# Altium project Stm32_Doom.PrjPcb (part 1 of 2)
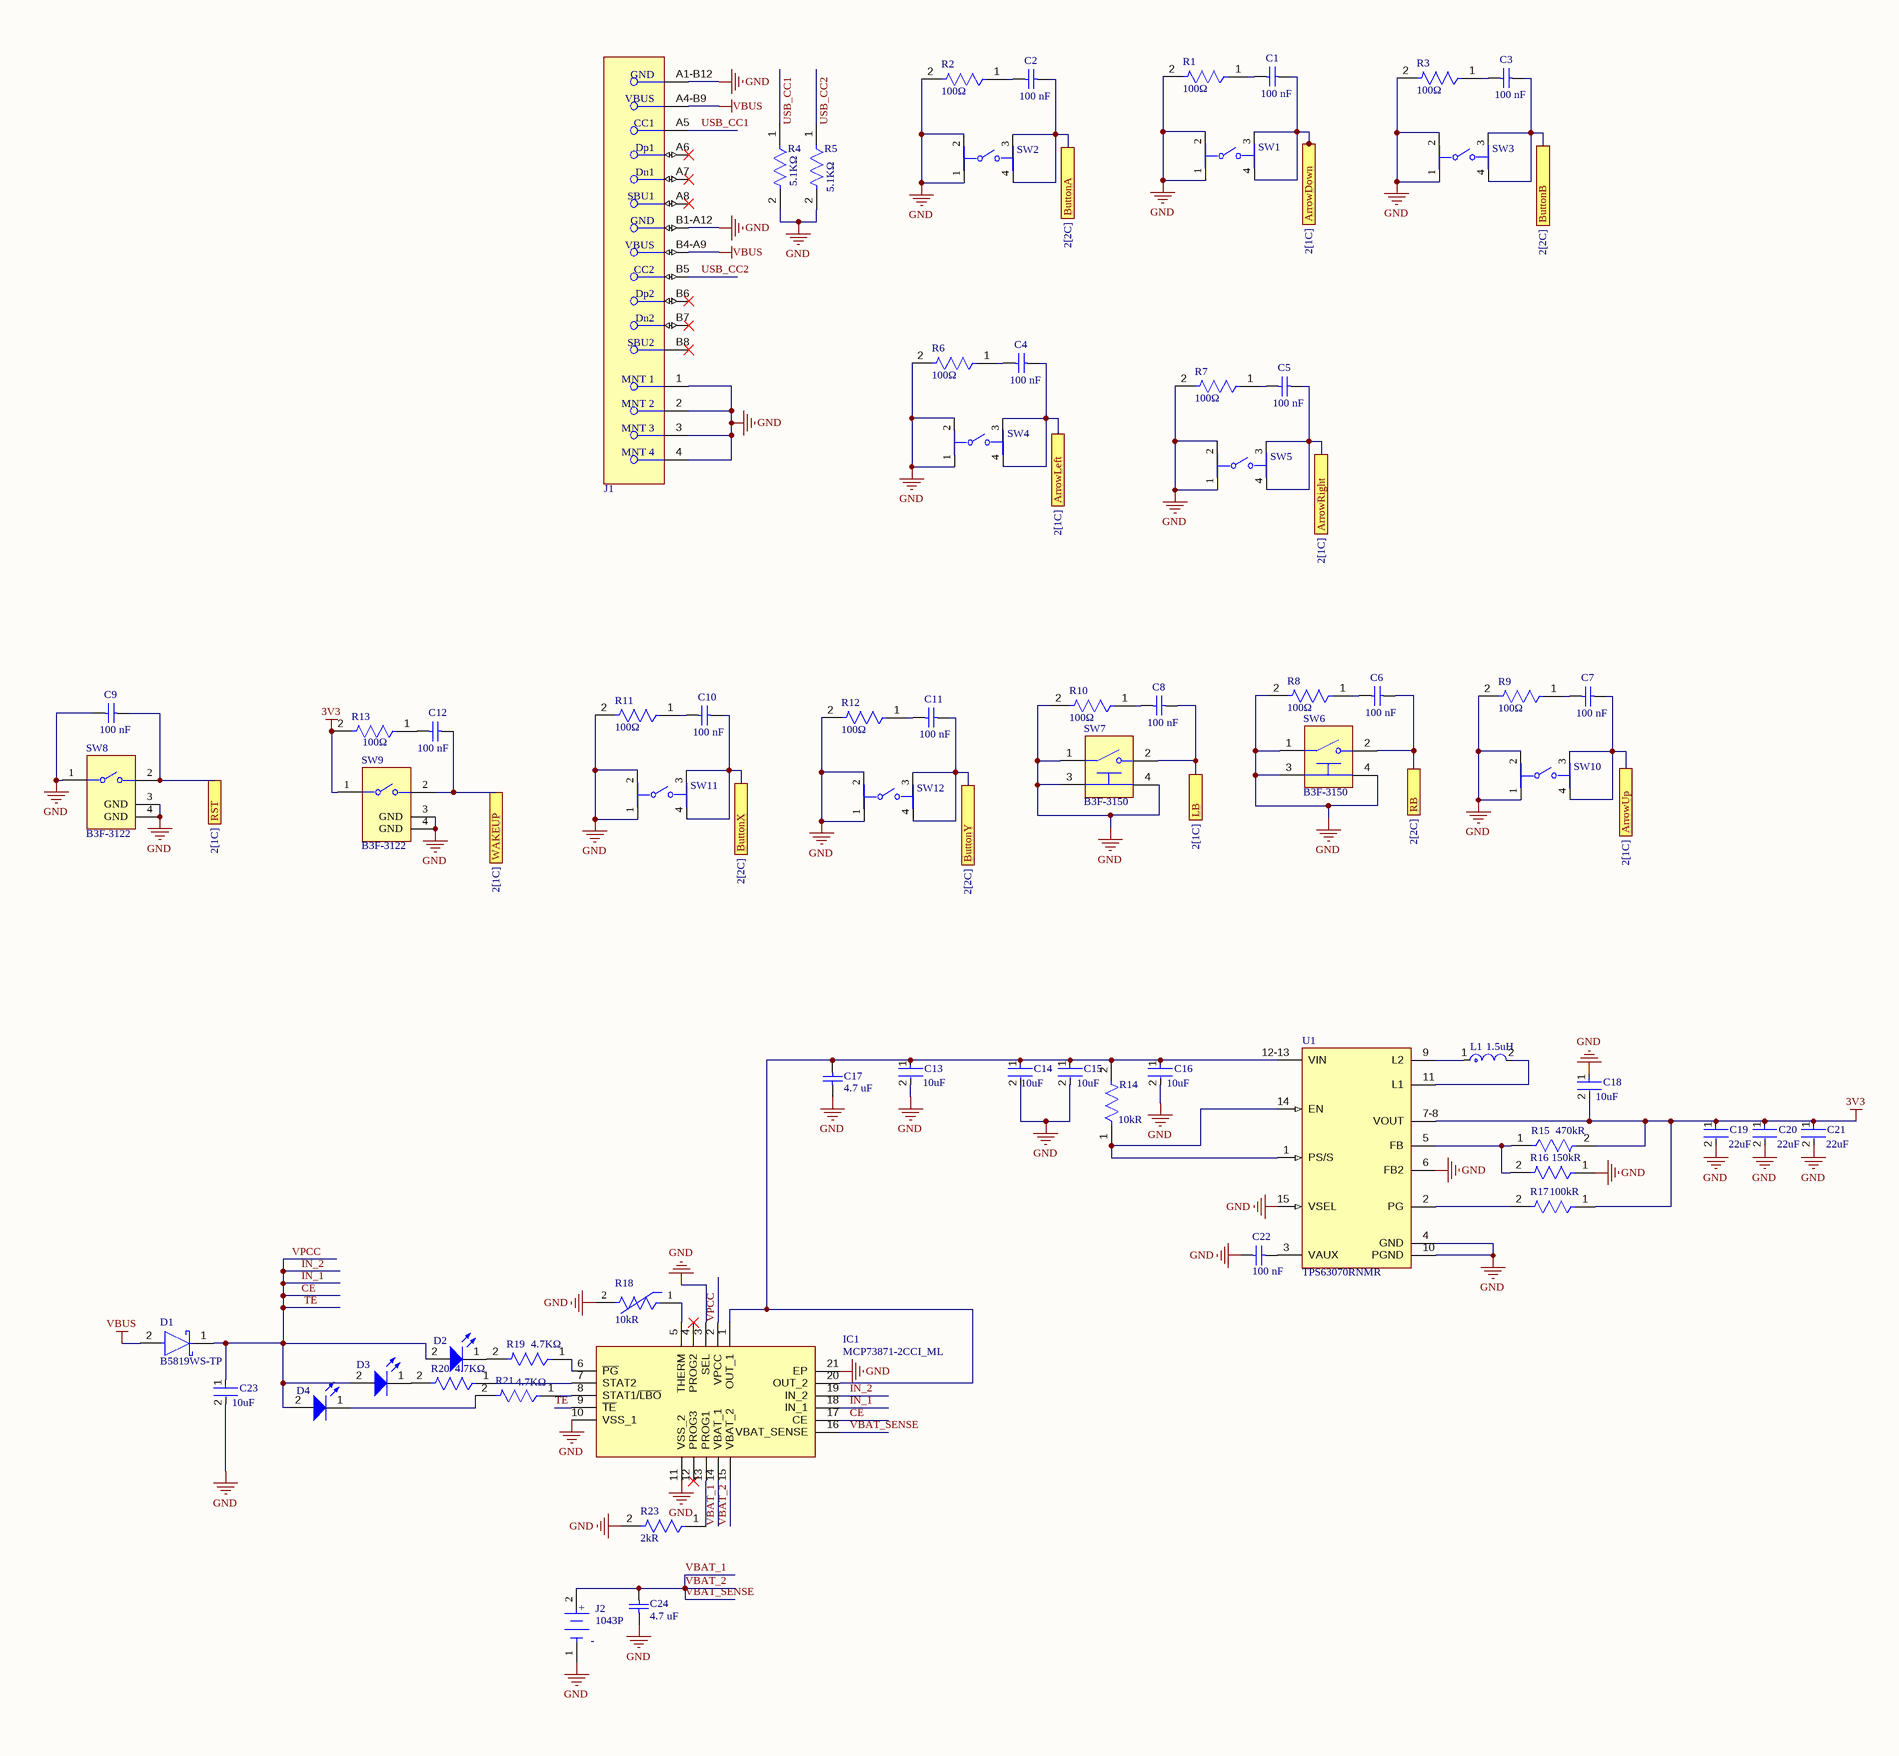
[diagram p0: POWER.SchDoc, left]
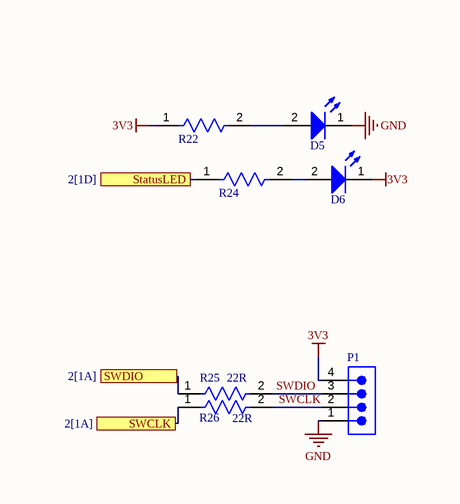
[diagram p1: POWER.SchDoc, right]
6 sheets, 155 parts. Net scope: flat (ports and power ports of the same name join across sheets).
Board file: PCB.PcbDoc
Sheets:
  POWER.SchDoc
  MCU.SchDoc
  SDCARD.SchDoc
  RAM.SchDoc
  LCD.SchDoc
  AUDIO.SchDoc

## Sheet POWER.SchDoc
size A2; SheetNumber: 1; SheetTotal: 6; SPICEModelCacheZVIZADMF: <root> / <DocumentId>ZVIZADMF</DocumentId> / </root>

### Parts
C1  value 100 nF  [CAPC2013X145X50LL20T25]  (hidden comment: C0805C104K9RACTU)
C2  value 100 nF  [CAPC2013X145X50LL20T25]  (hidden comment: C0805C104K9RACTU)
C3  value 100 nF  [CAPC2013X145X50LL20T25]  (hidden comment: C0805C104K9RACTU)
C4  value 100 nF  [CAPC2013X145X50LL20T25]  (hidden comment: C0805C104K9RACTU)
C5  value 100 nF  [CAPC2013X145X50LL20T25]  (hidden comment: C0805C104K9RACTU)
C6  value 100 nF  [CAPC2013X145X50LL20T25]  (hidden comment: C0805C104K9RACTU)
C7  value 100 nF  [CAPC2013X145X50LL20T25]  (hidden comment: C0805C104K9RACTU)
C8  value 100 nF  [CAPC2013X145X50LL20T25]  (hidden comment: C0805C104K9RACTU)
C9  value 100 nF  [CAPC2013X145X50LL20T25]  (hidden comment: C0805C104K9RACTU)
C10  value 100 nF  [CAPC2013X145X50LL20T25]  (hidden comment: C0805C104K9RACTU)
C11  value 100 nF  [CAPC2013X145X50LL20T25]  (hidden comment: C0805C104K9RACTU)
C12  value 100 nF  [CAPC2013X145X50LL20T25]  (hidden comment: C0805C104K9RACTU)
C13  Capacitance: 10uF  [FP-CL21-IPC_C]  (hidden comment: CL21A106MPFNNNF)
C14  Capacitance: 10uF  [FP-CL21-IPC_C]  (hidden comment: CL21A106MPFNNNF)
C15  Capacitance: 10uF  [FP-CL21-IPC_C]  (hidden comment: CL21A106MPFNNNF)
C16  Capacitance: 10uF  [FP-CL21-IPC_C]  (hidden comment: CL21A106MPFNNNF)
C17  value 4.7 uF  [CAPC2013X145X50NL20T25]  (hidden comment: C0805C475K9PACTU)
C18  Capacitance: 10uF  [FP-CL21-IPC_C]  (hidden comment: CL21A106MPFNNNF)
C19  Capacitance: 22uF  [FP-CL21-IPC_B]  (hidden comment: CL21A226MQCLQNC)
C20  Capacitance: 22uF  [FP-CL21-IPC_B]  (hidden comment: CL21A226MQCLQNC)
C21  Capacitance: 22uF  [FP-CL21-IPC_B]  (hidden comment: CL21A226MQCLQNC)
C22  value 100 nF  [CAPC1005X56X25LL10T15]  (hidden comment: 0402ZD104JAT2A)
C23  Capacitance: 10uF  [FP-CL21-IPC_C]  (hidden comment: CL21A106MPFNNNF)
C24  value 4.7 uF  [CAPC2013X145X50NL20T25]  (hidden comment: C0805C475K9PACTU)
D1  B5819WS-TP  [FP-SOD-323-IPC_C]
D2  150080BS75000  [WL-SMCW_0805_150080xx75000]  (value not drawn)
D3  150080BS75000  [WL-SMCW_0805_150080xx75000]  (value not drawn)
D4  150080BS75000  [WL-SMCW_0805_150080xx75000]  (value not drawn)
D5  150080BS75000  [WL-SMCW_0805_150080xx75000]  (value not drawn)
D6  150080BS75000  [WL-SMCW_0805_150080xx75000]  (value not drawn)
IC1  MCP73871-2CCI_ML  [QFN50P400X400X100-21N-D]
J1  USB4105-GF-A  [FP-USB4105-GF-A-MFG]  (value not drawn)
J2  1043P  [FP-1043P-MFG]
L1  Inductance: 1.5uH  [FP-XFL4020-MFG]  (hidden comment: XFL4020-152MEC)
P1  TSW-104-08-L-S  [SMTC-TSW-104-08-X-S]  (value not drawn)
R1  value 100Ω  [FP-AC0805-MFG]  (hidden comment: AC0805JR-07100RL)
R2  value 100Ω  [FP-AC0805-MFG]  (hidden comment: AC0805JR-07100RL)
R3  value 100Ω  [FP-AC0805-MFG]  (hidden comment: AC0805JR-07100RL)
R4  value 5.1KΩ  [FP-RT0805-MFG]  (hidden comment: RT0805DRE075K1L)
R5  Resistance: 5.1KΩ  [FP-RT0805-MFG]  (hidden comment: RT0805DRE075K1L)
R6  value 100Ω  [FP-AC0805-MFG]  (hidden comment: AC0805JR-07100RL)
R7  value 100Ω  [FP-AC0805-MFG]  (hidden comment: AC0805JR-07100RL)
R8  value 100Ω  [FP-AC0805-MFG]  (hidden comment: AC0805JR-07100RL)
R9  value 100Ω  [FP-AC0805-MFG]  (hidden comment: AC0805JR-07100RL)
R10  value 100Ω  [FP-AC0805-MFG]  (hidden comment: AC0805JR-07100RL)
R11  value 100Ω  [FP-AC0805-MFG]  (hidden comment: AC0805JR-07100RL)
R12  value 100Ω  [FP-AC0805-MFG]  (hidden comment: AC0805JR-07100RL)
R13  value 100Ω  [FP-AC0805-MFG]  (hidden comment: AC0805JR-07100RL)
R14  Resistance: 10kR  [FP-CRCW1206-e3-IPC_C]  (hidden comment: CRCW120610K0FKEA)
R15  Resistance: 470kR  [FP-CR0805-IPC_A]  (hidden comment: CR0805-JW-474GLF)
R16  Resistance: 150kR  [FP-MCU0805-IPC_B]  (hidden comment: MCU08050C1503FP500)
R17  Resistance: 100kR  [FP-CR0805-MFG]  (hidden comment: CR0805-JW-104GLF)
R18  Resistance: 10kR  [FP-ERTJ1-MFG]  (hidden comment: ERT-J1VG103FA)
R19  value 4.7KΩ  [FP-RT0805-MFG]  (hidden comment: RT0805DRE074K7L)
R20  value 4.7KΩ  [FP-RT0805-MFG]  (hidden comment: RT0805DRE074K7L)
R21  value 4.7KΩ  [FP-RT0805-MFG]  (hidden comment: RT0805DRE074K7L)
R22  RT0805CRE075K1L  [FP-RT0805-MFG]  (value not drawn)
R23  Resistance: 2kR  [FP-MCR10-MFG]  (hidden comment: MCR10EZHJ202)
R24  RT0805CRE075K1L  [FP-RT0805-MFG]  (value not drawn)
R25  Resistance: 22R  [FP-RG2012-IPC_B]  (hidden comment: RG2012Q-220-D-T5)
R26  Resistance: 22R  [FP-RG2012-IPC_B]  (hidden comment: RG2012Q-220-D-T5)
SW1  1241.1612.23  [FP-1241_1612_23-MFG]  (value not drawn)
SW2  1241.1612.23  [FP-1241_1612_23-MFG]  (value not drawn)
SW3  1241.1612.23  [FP-1241_1612_23-MFG]  (value not drawn)
SW4  1241.1612.23  [FP-1241_1612_23-MFG]  (value not drawn)
SW5  1241.1612.23  [FP-1241_1612_23-MFG]  (value not drawn)
SW6  B3F-3150  [FP-B3F-3150-MFG]
SW7  B3F-3150  [FP-B3F-3150-MFG]
SW8  B3F-3122  [FP-B3F-3122-MFG]
SW9  B3F-3122  [FP-B3F-3122-MFG]
SW10  1241.1612.23  [FP-1241_1612_23-MFG]  (value not drawn)
SW11  1241.1612.23  [FP-1241_1612_23-MFG]  (value not drawn)
SW12  1241.1612.23  [FP-1241_1612_23-MFG]  (value not drawn)
U1  TPS63070RNMR  [FP-RNM0015A-MFG]

### Ports
ArrowDown (see 2[1C]), ArrowLeft (see 2[1C]), ArrowRight (see 2[1C]), ArrowUp (see 2[1C]), ButtonA (see 2[2C]), ButtonB (see 2[2C]), ButtonX (see 2[2C]), ButtonY (see 2[2C]), LB (see 2[1C]), RB (see 2[2C]), RST (see 2[1C]), StatusLED (see 2[1D]), SWCLK (see 2[1A]), SWDIO (see 2[1A]), WAKEUP (see 2[1C])

### Nets
3V3: C18.2 C19.1 C20.1 C21.1 D6.1(K) P1.4 R13.2 R15.2 R17.1 R22.1 SW9.1 U1.7-8(VOUT)  [project net AVDD]
GND: C9.1 C13.2 C14.2 C15.2 C16.2 C17.1 C18.1 C19.2 C20.2 C21.2 C22.2 C23.2 C24.1 D5.1(K) IC1.3(SEL) IC1.10(VSS_1) IC1.11(VSS_2) IC1.21(EP) J1.1(MNT_1) J1.2(MNT_2) J1.3(MNT_3) J1.4(MNT_4) J1.A1-B12(GND) J1.B1-A12(GND) J2.1(C) P1.1 R1.2 R2.2 R3.2 R4.2 R5.2 R6.2 R7.2 R8.2 R9.2 R10.2 R11.2 R12.2 R16.1 R18.2 R23.2 SW1.1 SW1.2 SW2.1 SW2.2 SW3.1 SW3.2 SW4.1 SW4.2 SW5.1 SW5.2 SW6.1 SW6.3(MNT_1) SW6.4(MNT_2) SW7.1 SW7.3(MNT_1) SW7.4(MNT_2) SW8.1 SW8.3(GND) SW8.4(GND) SW9.3(GND) SW9.4(GND) SW10.1 SW10.2 SW11.1 SW11.2 SW12.1 SW12.2 U1.4(GND) U1.6(FB2) U1.10(PGND) U1.15(VSEL)
VBUS: D1.2(A) J1.A4-B9(VBUS) J1.B4-A9(VBUS)
CE: C23.1 D1.1(C) D2.2(A) D3.2(A) D4.2(A) IC1.2(VPCC) IC1.9(~{TE}) IC1.17(CE) IC1.18(IN_1) IC1.19(IN_2)  [also labelled IN_1, IN_2, TE, VPCC]
PA0: C12.2 SW9.2 ; port WAKEUP
PA8: C8.2 SW7.2 ; port LB
PA12: C6.2 SW6.2 ; port RB
PA13: R25.1 ; port SWDIO
PA14: R26.1 ; port SWCLK
PB12: C2.2 SW2.3 SW2.4 ; port ButtonA
PB14: C3.2 SW3.3 SW3.4 ; port ButtonB
PC8: C4.2 SW4.3 SW4.4 ; port ArrowLeft
PC13: R24.1 ; port StatusLED
PD8: C10.2 SW11.3 SW11.4 ; port ButtonX
PD9: C11.2 SW12.3 SW12.4 ; port ButtonY
PD11: C7.2 SW10.3 SW10.4 ; port ArrowUp
PD14: C1.2 SW1.3 SW1.4 ; port ArrowDown
PD15: C5.2 SW5.3 SW5.4 ; port ArrowRight
RST: C9.2 SW8.2 ; port RST
SWCLK: P1.2 R26.2
SWDIO: P1.3 R25.2
USB_CC1: J1.A5(CC1) R4.1
USB_CC2: J1.B5(CC2) R5.1
VBAT_1: C24.2 IC1.14(VBAT_1) IC1.15(VBAT_2) IC1.16(VBAT_SENSE) J2.2(A)  [also labelled VBAT_2, VBAT_SENSE]
NetC1_1: C1.1 R1.1
NetC2_1: C2.1 R2.1
NetC3_1: C3.1 R3.1
NetC4_1: C4.1 R6.1
NetC5_1: C5.1 R7.1
NetC6_1: C6.1 R8.1
NetC7_1: C7.1 R9.1
NetC8_1: C8.1 R10.1
NetC10_1: C10.1 R11.1
NetC11_1: C11.1 R12.1
NetC12_1: C12.1 R13.1
NetC13_1: C13.1 C14.1 C15.1 C16.1 C17.2 IC1.1(OUT_1) IC1.20(OUT_2) R14.2 U1.12-13(VIN)
NetC22_1: C22.1 U1.3(VAUX)
NetD2_1: D2.1(K) R19.2
NetD3_1: D3.1(K) R20.2
NetD4_1: D4.1(K) R21.2
NetD5_2: D5.2(A) R22.2
NetD6_2: D6.2(A) R24.2
NetIC1_5: IC1.5(THERM) R18.1
NetIC1_6: IC1.6(~{PG}) R19.1
NetIC1_7: IC1.7(STAT2) R20.1
NetIC1_8: IC1.8(STAT1/~{LBO}) R21.1
NetIC1_13: IC1.13(PROG1) R23.1
NetL1_1: L1.1 U1.9(L2)
NetL1_2: L1.2 U1.11(L1)
NetR14_1: R14.1 U1.1(PS/S) U1.14(EN)
NetR15_1: R15.1 R16.2 U1.5(FB)
NetR17_2: R17.2 U1.2(PG)

Not connected (* = marked no-connect by the designer): IC1 4(PROG2)* 12(PROG3)*; J1 A6(Dp1)* A7(Dn1)* A8(SBU1)* B6(Dp2)* B7(Dn2)* B8(SBU2)*

### Notes on the sheet
- DWG NO:
- REV:
- THIS DOCUMENT AND THE DATA DISCLOSED HEREIN OR
- HEREWITH IS THE PROPERTY OF ALTIUM LIMITED AND MAY
- BE FREELY DISTRIBUTED IN WHOLE. NO RIGHTS ARE
- RESERVED OR EXPRESS OR IMPLIED WARANTEE GIVEN.
- REVISION
- DESCRIPTION
- DATE
- APPROVED
- ENG:
- APPROVALS
- PROJECT
- DSN:
- CHK:
- REFERENCE DOCUMENTS
- PROJECT REVISION:
- TITLE
- DOCUMENT REVISION:
- DESIGN ITEM:
- BOM:
- FAB DWG:
- PCB DWG:
- ASSY DWG:
- SCALE:
- A2
- SIZE
- CAGE CODE
- FILE NAME
- DWG NO.
- SHEET
- OF
- REV
- (in symbol CMP-19636-000034-1) +

### Library data of the parts
C1-C12 = CMP-1036-04391-2: Manufacturer: Kemet; Part Number: C0805C104K9RACTU
C13-C16 C18 C23 = CMP-13271-002245-1: CL21 Series 0805 10uF 10V ±20% Tolerance X5R Multilayer Ceramic Chip Capacitor; Voltage Rating (DC): 10V; Mount: Surface Mount; Tolerance: 20%; Case/Package: 0805; Voltage Rating: 10V; Dielectric: X5R; Max Operating Temperature: 85°C; Packaging: Tape and Reel; Height: 1.25mm; Thickness: 0.053inch; Width: 0.049inch; Length: 2mm; Radiation Hardening: No; Min Operating Temperature: -55°C; Depth: 1.25mm; Package Quantity: 10000
C17 C24 = CMP-2007-01009-1: Manufacturer: Kemet; Part Number: C0805C475K9PACTU
C19-C21 = CMP-13271-001454-1: CL21 Series 0805 22uF 6.3V ±20% Tolerance X5R Multilayer Ceramic Chip Capacitor; Mount: Surface Mount; Voltage Rating: 6.3V; Radiation Hardening: No; Thickness: 0.037inch; Packaging: Tape and Reel; Width: 0.049inch; Tolerance: 20%; Case Code (Imperial): 0805; Dielectric: X5R; Case Code (Metric): 2012; Package Quantity: 1; Lead Free: Lead Free; Case/Package: 0805; Min Operating Temperature: -55°C; Depth: 1.25mm; Length: 2mm; Height: 0.85mm; Max Operating Temperature: 85°C
C22 = CMP-2008-02899-1: Manufacturer: AVX Interconnect / Elco; Part Number: 0402ZD104JAT2A
D1 = CMP-56206-000009-1: DIODE SCHOTTKY 40V 1A SOD323; Max Reverse Leakage Current: 1mA; Peak Non-Repetitive Surge Current: 10A; Forward Voltage: 900mV; Element Configuration: Single; Max Reverse Voltage (DC): 40V; Number of Pins: 2; Max Operating Temperature: 125°C; Package Quantity: 1; Radiation Hardening: No; Average Rectified Current: 1A; Lead Free: Lead Free; Series: -; Mount: Surface Mount; Min Operating Temperature: -65°C; RoHS Compliant: Yes; Packaging: Tape and Reel; Max Surge Current: 10A
D2-D6 = CMP-1426-00008-7: Led, Blue, 470 Nm, 3.2 V, 30 Ma, 145 Mcd Rohs Compliant: Yes; Dominant Wavelength: 470nm; Max Junction Temperature (Tj): 95°C; Power Dissipation: 105mW; Peak Wavelength: 465nm; Max Reverse Voltage (DC): 5V; Forward Current: 100mA; Test Current: 20mA; Luminous Intensity: 145mcd; Lens Style: Clear, Rectangular; Viewing Angle: 140°; Forward Voltage: 3.2V; Color: Blue; Height: 700µm; Case Code (Imperial): 0805; Width: 1.25mm; REACH SVHC: Unknown; Case/Package: 0805; Lead Free: Lead Free; Mount: Surface Mount; Packaging: Tape and Reel; RoHS: Compliant; Reverse Voltage: 5V; Min Operating Temperature: -40°C; Case Code (Metric): 2012; Wavelength: 470nm; Max Operating Temperature: 85°C; Length: 2mm
IC1 = MCP73871-2CCI_ML: Integrated Circuit; Manufacturer_Name: Microchip; Manufacturer_Part_Number: MCP73871-2CCI/ML; Datasheet Link: https://datasheet.datasheetarchive.com/originals/distributors/Datasheets-DGA15/728881.pdf; Height: 1mm; Mouser Part Number: 579-MCP73871-2CCI/ML; Mouser Price/Stock: https://www.mouser.co.uk/ProductDetail/Microchip-Technology/MCP73871-2CCI-ML?qs=qXsUupcbpXyQfJ2clznZxw%3D%3D; Arrow Part Number: MCP73871-2CCI/ML; Arrow Price/Stock: https://www.arrow.com/en/products/mcp73871-2cciml/microchip-technology?utm_currency=USD&region=nac
J1 = CMP-245163-000001-1: CONN RCPT USB2.0 TYPEC 5A; Manufacturer: GCT; Voltage Rating: 20V; Is Female: yes; Current Rating: 5/6.25/1.25/0.25A; Number Of Contacts: 16; Conn Orientation: Right Angle; Device Class L1: Connectors; Category: Conn; Lead Free: Yes; RoHS: TRUE; Temperature Range High: +85°C; Digikey Description: CONN RCPT USB2.0 TYPEC 5A; Device Class L3: unset; ComponentLink2Description: Datasheet; Manufacturer Part Number: USB4105-GF-A; Package: 0; Usb Standard: USB 2.0; Device Class L2: USB Connectors; Automotive: No; Temperature Range Low: -40°C; Height: 3.46mm; Temperature: -40°C to +85°C; Contact Material: Gold,Nickel; ComponentLink2URL: https://gct.co/files/drawings/usb4105.pdf; Octopart: https://octopart.com/usb4105-gf-a-gct-106627878
J2 = CMP-19636-000034-1: BATT HOLDER 18650 1 CELL PC PIN; Number of Cells: 1; Series: -; Termination: PC Pin; Package Quantity: 50; Min Operating Temperature: -50°C; Mount: Through Hole; Packaging: Tray; Max Operating Temperature: 145°C
L1 = CMP-11268-000104-1: Inductor Power Shielded Wirewound 1.5uH 20% 100KHz 9.1A 15.8mOhm DCR 1515 Automotive Embossed Plastic T/R; Core Material: Composite; DC Resistance (DCR): 15.8mR; Saturation Current: 4.1A; Self Resonant Frequency: 59MHz; Tolerance: 20%; Max DC Current: 9.1A; RoHS Compliant: Yes; Max Operating Temperature: 125°C; Length: 4.3mm; Case/Package: SMD/SMT; Mount: Surface Mount; Shielding: Shielded; Min Operating Temperature: -40°C; RMS Current (Irms): 9.1A; Test Frequency: 100kHz; Inductance Tolerance: 20%; REACH SVHC: No SVHC; Packaging: Tape and Reel; Termination: SMD/SMT; Lead Free: Contains Lead; Width: 4.3mm; Series: XFL4020; Height: 2.1mm
P1 = CMP-1024-00358-1: 0.025" SQ Post Header, Through-hole, Vertical, -55 to 125 degC, 2.54 mm Pitch, 4-Pin, Male, RoHS; Manufacturer: Samtec; Pitch: 2.54 mm; PartNumber: TSW-104-08-L-S; RoHS: True; Temperature Range: -55 to 125 degC; PackageDescription: .025[0.64] SQ. Post Terminal Strip Assembly; Orientation: Vertical; ComponentLink2URL: http://www.samtec.com/documents/webfiles/pdf/TSW_TH.PDF; ComponentLink1Description: Manufacturer URL; ComponentLink2Description: Datasheet; PackageVersion: DM, 8/1988; ComponentLink3URL: http://www.samtec.com/documents/webfiles/cpdf/TSW-XXX-XX-XXX-X-XX-XXX-MKT.pdf; Mounting Technology: Through-hole; PackageReference: TSW-104-08-X-S; ComponentLink3Description: Package Specification; ComponentLink1URL: http://www.samtec.com; DatasheetVersion: F-214
R1-R3 R6-R13 = CMP-03412-037659-1: RES SMD 100 OHM 5% 1/8W 0805; Manufacturer: Yageo; Voltage Rating: 150V; Automotive Grade: Grade 0; Tolerance: 0.05; Temperature: -55°C to +155°C; Height: 0.6mm; Series: AC; Manufacturer Part Number: AC0805JR-07100RL; Digikey Description: RES SMD 100 OHM 5% 1/8W 0805; ComponentLink2URL: http://www.yageo.com/documents/recent/PYu-AC_51_RoHS_L_6.pdf; ComponentLink2Description: Datasheet; Ipc Land Pattern Name: RESC200125X50; Lead Free: Yes; Package: AC0805; Resistance: 100Ω; Device Class L2: Resistors; Composition: Thick Film; Temperature Range Low: -55°C; Temperature Range High: +155°C; RoHS: TRUE; Mouser Description: Thick Film Resistors - SMD 1/8W 100ohm 5% AEC-Q200; Automotive: Yes; Device Class L1: Passive Components; Power Rating: 1/8W; Category: Res; Octopart: https://octopart.com/ac0805jr-07100rl-yageo-30510952; Device Class L3: Chip SMD Resistors; Footprint Url: http://www.yageo.com/exep/pages/download/literatures/PYu-R_Mount_10.pdf
R4 = CMP-03412-022555-1: RES SMD 5.1K OHM 0.5% 1/8W 0805; Manufacturer: Yageo; Temperature Coefficient: 50 ppm/°C; Tolerance: 0.01; Voltage Rating: 150V; Power Rating: 0.125W; Manufacturer Part Number: RT0805DRE075K1L; Device Class L3: Chip SMD Resistors; Digikey Description: RES SMD 5.1K OHM 0.5% 1/8W 0805; Series: RT; ComponentLink2URL: http://www.yageo.com/documents/recent/PYu-RT_1-to-0.01_RoHS_L_9.pdf; Lead Free: Yes; Octopart: https://octopart.com/rt0805dre075k1l-yageo-1467682; ComponentLink2Description: Datasheet; Temperature Range High: +155°C; Temperature Range Low: -55°C; Resistance: 5.1KΩ; Composition: Thin Film; Height: 0.6mm; Device Class L2: Resistors; Ipc Land Pattern Name: RESC200125X50; Package: RT0805; Category: Res; Footprint Url: http://www.yageo.com/exep/pages/download/literatures/PYu-R_Mount_10.pdf; Temperature: -55°C to +155°C; RoHS: TRUE; Automotive: No; Device Class L1: Passive Components
R5 = CMP-03412-022555-1: RES SMD 5.1K OHM 0.5% 1/8W 0805; Manufacturer: Yageo; Temperature Coefficient: 50 ppm/°C; Value: 5.1KΩ; Tolerance: 0.01; Voltage Rating: 150V; Power Rating: 0.125W; Manufacturer Part Number: RT0805DRE075K1L; Device Class L3: Chip SMD Resistors; Digikey Description: RES SMD 5.1K OHM 0.5% 1/8W 0805; Series: RT; ComponentLink2URL: http://www.yageo.com/documents/recent/PYu-RT_1-to-0.01_RoHS_L_9.pdf; Lead Free: Yes; Octopart: https://octopart.com/rt0805dre075k1l-yageo-1467682; ComponentLink2Description: Datasheet; Temperature Range High: +155°C; Temperature Range Low: -55°C; Composition: Thin Film; Height: 0.6mm; Device Class L2: Resistors; Ipc Land Pattern Name: RESC200125X50; Package: RT0805; Category: Res; Footprint Url: http://www.yageo.com/exep/pages/download/literatures/PYu-R_Mount_10.pdf; Temperature: -55°C to +155°C; RoHS: TRUE; Automotive: No; Device Class L1: Passive Components
R14 = CMP-2003-04807-2: RES Thick Film, 10kΩ, 1%, 0.25W, 100ppm/°C, 1206; Working Voltage: 200V; Max Power Dissipation: 250mW; Tolerance: 1%; Width: 0.063inch; Height: 0.55mm; Number of Pins: 2; Voltage Rating: 200V; Temperature Coefficient: 100ppm/°C; Military Standard: Not; Features: Automotive AEC-Q200; Depth: 1.6mm; Radiation Hardening: No; Termination: SMD/SMT; Case Code (Imperial): 1206; Weight: 0.000353oz; Length: 3.2mm; Package Quantity: 10; Voltage Rating (DC): 200V; Case/Package: 1206; Min Operating Temperature: -55°C; Number of Terminations: 2; Composition: Thick Film; Contact Plating: Tin; Power Rating: 250mW; Packaging: Tape and Reel; Max Operating Temperature: 155°C; Lead Free: Lead Free; Case Code (Metric): 3216
R15 = CMP-07231-006605-1: Thick Film Chip Resistors 0805 470kΩ 0.125W 5% 200ppm/°C; Max Power Dissipation: 125mW; Voltage Rating: 150V; Radiation Hardening: No; Construction: Rectangular; Width: 0.049inch; Termination: SMD/SMT; Packaging: Tape and Reel; Min Operating Temperature: -55°C; Series: CR0805; Contact Plating: Tin; Tolerance: 5%; Power Rating: 125mW; Weight: 0.000194oz; Number of Terminations: 2; Package Quantity: 10000; Max Operating Temperature: 155°C; Case Code (Metric): 2012; Case/Package: 0805; Features: Moisture Resistant; Temperature Coefficient: 200ppm/°C; Depth: 1.25mm; Mount: Surface Mount; Thickness: 508um; Military Standard: Not; Length: 2mm; Case Code (Imperial): 0805; Height: 0.024inch; Resistor Type: Thick Film
R16 = CMP-02407-003613-1: RES 1.05K OHM 0.5% 1/5W 0805; Max Power Dissipation: 200mW; Temperature Coefficient: 50ppm/°C; Tolerance: 1%; Military Standard: Not; Packaging: Tape and Reel; Length: 0.079inch; Max Operating Temperature: 125°C; Case/Package: 0805; Min Operating Temperature: -55°C; Width: 0.049inch; Composition: Thin Film; Number of Terminations: 2; Radiation Hardening: No; Package Quantity: 5000; Lead Free: Lead Free; Contact Plating: Tin; Depth: 1.25mm; Height: 0.022inch
R17 = CMP-07231-001707-1: Thick Film Chip Resistors 0805 100kΩ 0.125W 5% 200ppm/°C; Power Rating: 125mW; Voltage Rating: 150V; Case Code (Metric): 2012; Case Code (Imperial): 0805; Temperature Coefficient: 200ppm/°C; Mount: Surface Mount; Tolerance: 5%; Radiation Hardening: No; Military Standard: Not; Contact Plating: Tin; Number of Terminations: 2; Packaging: Tape and Reel; Thickness: 508um; Length: 0.079inch; Depth: 1.25mm; Min Operating Temperature: -55°C; Features: Moisture Resistant; Max Operating Temperature: 155°C; Width: 0.049inch; Package Quantity: 10000; Termination: SMD/SMT; Composition: Thick Film; Max Power Dissipation: 125mW; Height: 0.024inch; Case/Package: 0805
R18 = CMP-05419-000001-1: THERMISTOR NTC 10KOHM 3380K 0603; Max Power Dissipation: 100mW; Resistance Tolerance: 1%; Case Code (Imperial): 0603; Height: 0.8mm; Case/Package: 0603; Depth: 0.8mm; Min Operating Temperature: -40°C; Accuracy: 1%; Series: ERT-J; Termination: SMD/SMT; Length: 1.6mm; Number of Pins: 2; Lead Free: Lead Free; Power Rating: 100mW; Package Quantity: 4000; RoHS Compliant: Yes; Max Operating Temperature: 125°C; Width: 800um; REACH SVHC: No SVHC; Packaging: Tape and Reel; Tolerance: 1%; Mount: Surface Mount; Case Code (Metric): 1608; Radiation Hardening: No
R19-R21 = CMP-03412-005354-1: RES SMD 4.7K OHM 0.5% 1/8W 0805; Manufacturer: Yageo; Power Rating: 0.125W; Tolerance: 0.01; Voltage Rating: 150V; Temperature Coefficient: 50 ppm/°C; Lead Free: Yes; Device Class L2: Resistors; ComponentLink2Description: Datasheet; RoHS: TRUE; Package: RT0805; Resistance: 4.7KΩ; Device Class L3: Chip SMD Resistors; Ipc Land Pattern Name: RESC200125X50; Category: Res; Octopart: https://octopart.com/rt0805dre074k7l-yageo-1242027; Temperature: -55°C to +155°C; Temperature Range High: +155°C; Digikey Description: RES SMD 4.7K OHM 0.5% 1/8W 0805; Series: RT; Height: 0.6mm; Footprint Url: http://www.yageo.com/exep/pages/download/literatures/PYu-R_Mount_10.pdf; Device Class L1: Passive Components; Temperature Range Low: -55°C; Composition: Thin Film; Manufacturer Part Number: RT0805DRE074K7L; ComponentLink2URL: http://www.yageo.com/documents/recent/PYu-RT_1-to-0.01_RoHS_L_9.pdf; Automotive: No
R22 R24 = CMP-03412-005622-1: RES SMD 5.1K OHM 0.25% 1/8W 0805; Manufacturer: Yageo; Tolerance: 0.005; Value: 5.1KΩ; Voltage Rating: 150V; Power Rating: 0.125W; Temperature Coefficient: 50 ppm/°C; Temperature Range Low: -55°C; Device Class L3: Chip SMD Resistors; Series: RT; Automotive: No; Height: 0.6mm; Lead Free: Yes; Category: Res; ComponentLink2Description: Datasheet; ComponentLink2URL: http://www.yageo.com/documents/recent/PYu-RT_1-to-0.01_RoHS_L_9.pdf; Composition: Thin Film; Temperature Range High: +155°C; Device Class L1: Passive Components; Footprint Url: http://www.yageo.com/exep/pages/download/literatures/PYu-R_Mount_10.pdf; Package: RT0805; Device Class L2: Resistors; Resistance: 5.1KΩ; RoHS: TRUE; Digikey Description: RES SMD 5.1K OHM 0.25% 1/8W 0805; Temperature: -55°C to +155°C; Manufacturer Part Number: RT0805CRE075K1L; Octopart: https://octopart.com/rt0805cre075k1l-yageo-1479639; Ipc Land Pattern Name: RESC200125X50
R23 = CMP-08839-010481-1: Thick Film Chip Resistor, 0805, 2kΩ, 5%, 200ppm/°C, 0.125W, 150V; Max Power Dissipation: 125mW; Height: 0.024inch; Max Operating Temperature: 155°C; Temperature Coefficient: 200ppm/°C; Mount: Surface Mount; Contact Plating: Tin; Voltage Rating (DC): 150V; Power Rating: 125mW; Number of Terminations: 2; Case Code (Metric): 2012; Package Quantity: 5000; Size Code: 0805; Lead Free: Lead Free; Case Code (Imperial): 0805; Tolerance: 5%; Resistor Type: Thick Film; Width: 0.049inch; Length: 0.079inch; Case/Package: 0805; Packaging: Tape and Reel; Radiation Hardening: No; Series: MCR10; Min Operating Temperature: -55°C; RoHS Compliant: Yes
R25 R26 = CMP-28537-003551-1: Automotive Metal Thin Film Chip Resistor, 0805, 22Ω, 0.5%, 50ppm/°C, 0.125W, 150V; Power Rating: 125mW; Length: 2mm; Features: Automotive AEC-Q200; Tolerance: 0.5%; Packaging: Tape and Reel; Case/Package: 0805; Termination: SMD/SMT; Weight: 0.000194oz; Height: 0.4mm; Voltage Rating (DC): 150V; Voltage Rating: 150V; RoHS Compliant: Yes; Case Code (Imperial): 0805; Lead Free: Lead Free; Min Operating Temperature: -55°C; Resistor Type: Thin Film; Series: RG; Max Power Dissipation: 125mW; Max Operating Temperature: 155°C; Width: 1.2mm; Temperature Coefficient: 50ppm/°C; Case Code (Metric): 2012; Number of Terminations: 2
SW1-SW5 SW10-SW12 = CMP-26321-000007-1: SWITCH TACTILE SPST-NO 0.05A 42V; Max Current Rating: 50mA; Voltage Rating (AC): 30V; Switch Function: Off-Mom; Illumination Type: Non-Illuminated; Mechanical Life: 1000000Cycles; Actuator Type: Standard; Ratings: IP40; Switch Travel: 0.35mm; Actuator Material: Polyphenylene; Operating Force: 1.6N; Throw Configuration: SPST; Contact Plating: Gold; Mount: Surface Mount; Contact Material: Gold; Termination: Gull Wing; Min Operating Temperature: -40°C; Series: SMS; Depth: 15.9mm; Radiation Hardening: No; Lead Free: Lead Free; Max Operating Temperature: 85°C; Length: 11.4mm; Voltage Rating (DC): 42V; Current Rating: 50mA; Packaging: Tape and Reel; Housing Material: Polyamide; Package Quantity: 450; Max Voltage Rating (AC): 30V; Orientation: Straight; Weight: 0.070548oz; Max Voltage Rating (DC): 42V
SW6 SW7 = CMP-08834-000006-1: SWITCH TACTILE SPST-NO 0.05A 24V; Manufacturer: Omron; Contact Current Rating: 50mA; Electromechanical Life: 1000000Cycles; Contact Resistance: 100mΩ; Operating Force: 0.98N; Octopart: https://octopart.com/b3f-3150-omron-49234; Device Class L1: Electromechanical; Device Class L2: Switches; Temperature Range Low: -25°C; Temperature Range High: +70°C; Mouser Description: Tactile Switches R/A 6X6 6.15mm BTN; Temperature: -25°C to +70°C; Voltage Rating Dc: 24V; Automotive: No; Ambient Temperature Range Low: -25°C; Ambient Temperature Range High: +70°C; Mount: Through Hole; ComponentLink2URL: https://omronfs.omron.com/en_US/ecb/products/pdf/en-b3f.pdf; RoHS: TRUE; ComponentLink2Description: Datasheet; Digikey Description: SWITCH TACTILE SPST-NO 0.05A 24V; Package: 0; Height: 7.8mm; Throw Configuration: SPST-NO; Lead Free: Yes; Device Class L3: Tactile Switches; Category: Switch; Manufacturer Part Number: B3F-3150
SW8 SW9 = CMP-08834-000053-1: SWITCH TACTILE SPST-NO 0.05A 24V; Max Current Rating: 50mA; Actuator Type: Standard; Ratings: IP00; Number of Poles: 1; Mechanical Life: 300000Cycles; Illumination Type: Non-Illuminated; Switch Function: Off-Mom; Actuator Color: Grey; Contact Resistance: 100mR; Throw Configuration: SPST; Actuator Length: 1.6mm; Switch Travel: 0.25mm; Operating Force: 1.47N; Weight: 0.25g; Voltage Rating (DC): 24V; Contact Plating: Gold; RoHS Compliant: Yes; Contact Material: Gold; Radiation Hardening: No; Packaging: Bulk; Height: 7.4mm; Min Operating Temperature: -25°C; Electrical Life: 300000Cycles; Depth: 7.85mm; Max Voltage Rating (DC): 24V; Mount: Through Hole; Width: 6.25mm; Current Rating: 50mA; Lead Free: Lead Free; Max Operating Temperature: 70°C; Series: B3F; Contact Current Rating: 50mA; Package Quantity: 1000; Termination: PC Pins; Orientation: Right Angle; Length: 7.3mm
U1 = CMP-04918-000001-1: IC REG BCK BST ADJ 2A 15VQFN; Manufacturer Part Number: TPS63070RNMT; Manufacturer: Texas Instruments; Number Of Outputs: 1; Max Duty Cycle: 100%; Output Type: AdjustableProgrammable; Max Supply Voltage: 16V; Max Junction Temp: +125°C; Switching Topology: Buck-Boost; Output Voltage: 2.5-9V; Standoff Height: 0mm; Min Supply Voltage: 2V; Switching Frequency: 2400kHz; Nominal Supply Current: 5-54uA; Temperature: -40°C to +125°C; Device Class L1: Integrated Circuits (ICs); RoHS: TRUE; Package: RNM0015A; Octopart: https://octopart.com/tps63070rnmt-texas+instruments-75117739; Output Current: 2A; Device Class L3: Voltage Regulators - Switching; Temperature Range High: +125°C; ComponentLink2Description: Datasheet; ComponentLink2URL: http://www.ti.com/lit/ds/symlink/tps63070.pdf; Lead Free: Yes; Device Class L2: Power Management ICs; Automotive: No; Height: 1mm; Temperature Range Low: -40°C; Category: IC; Digikey Description: IC REG BCK BST ADJ 2A 15VQFN

## Sheet MCU.SchDoc
size A3; SheetNumber: 2; SheetTotal: 6
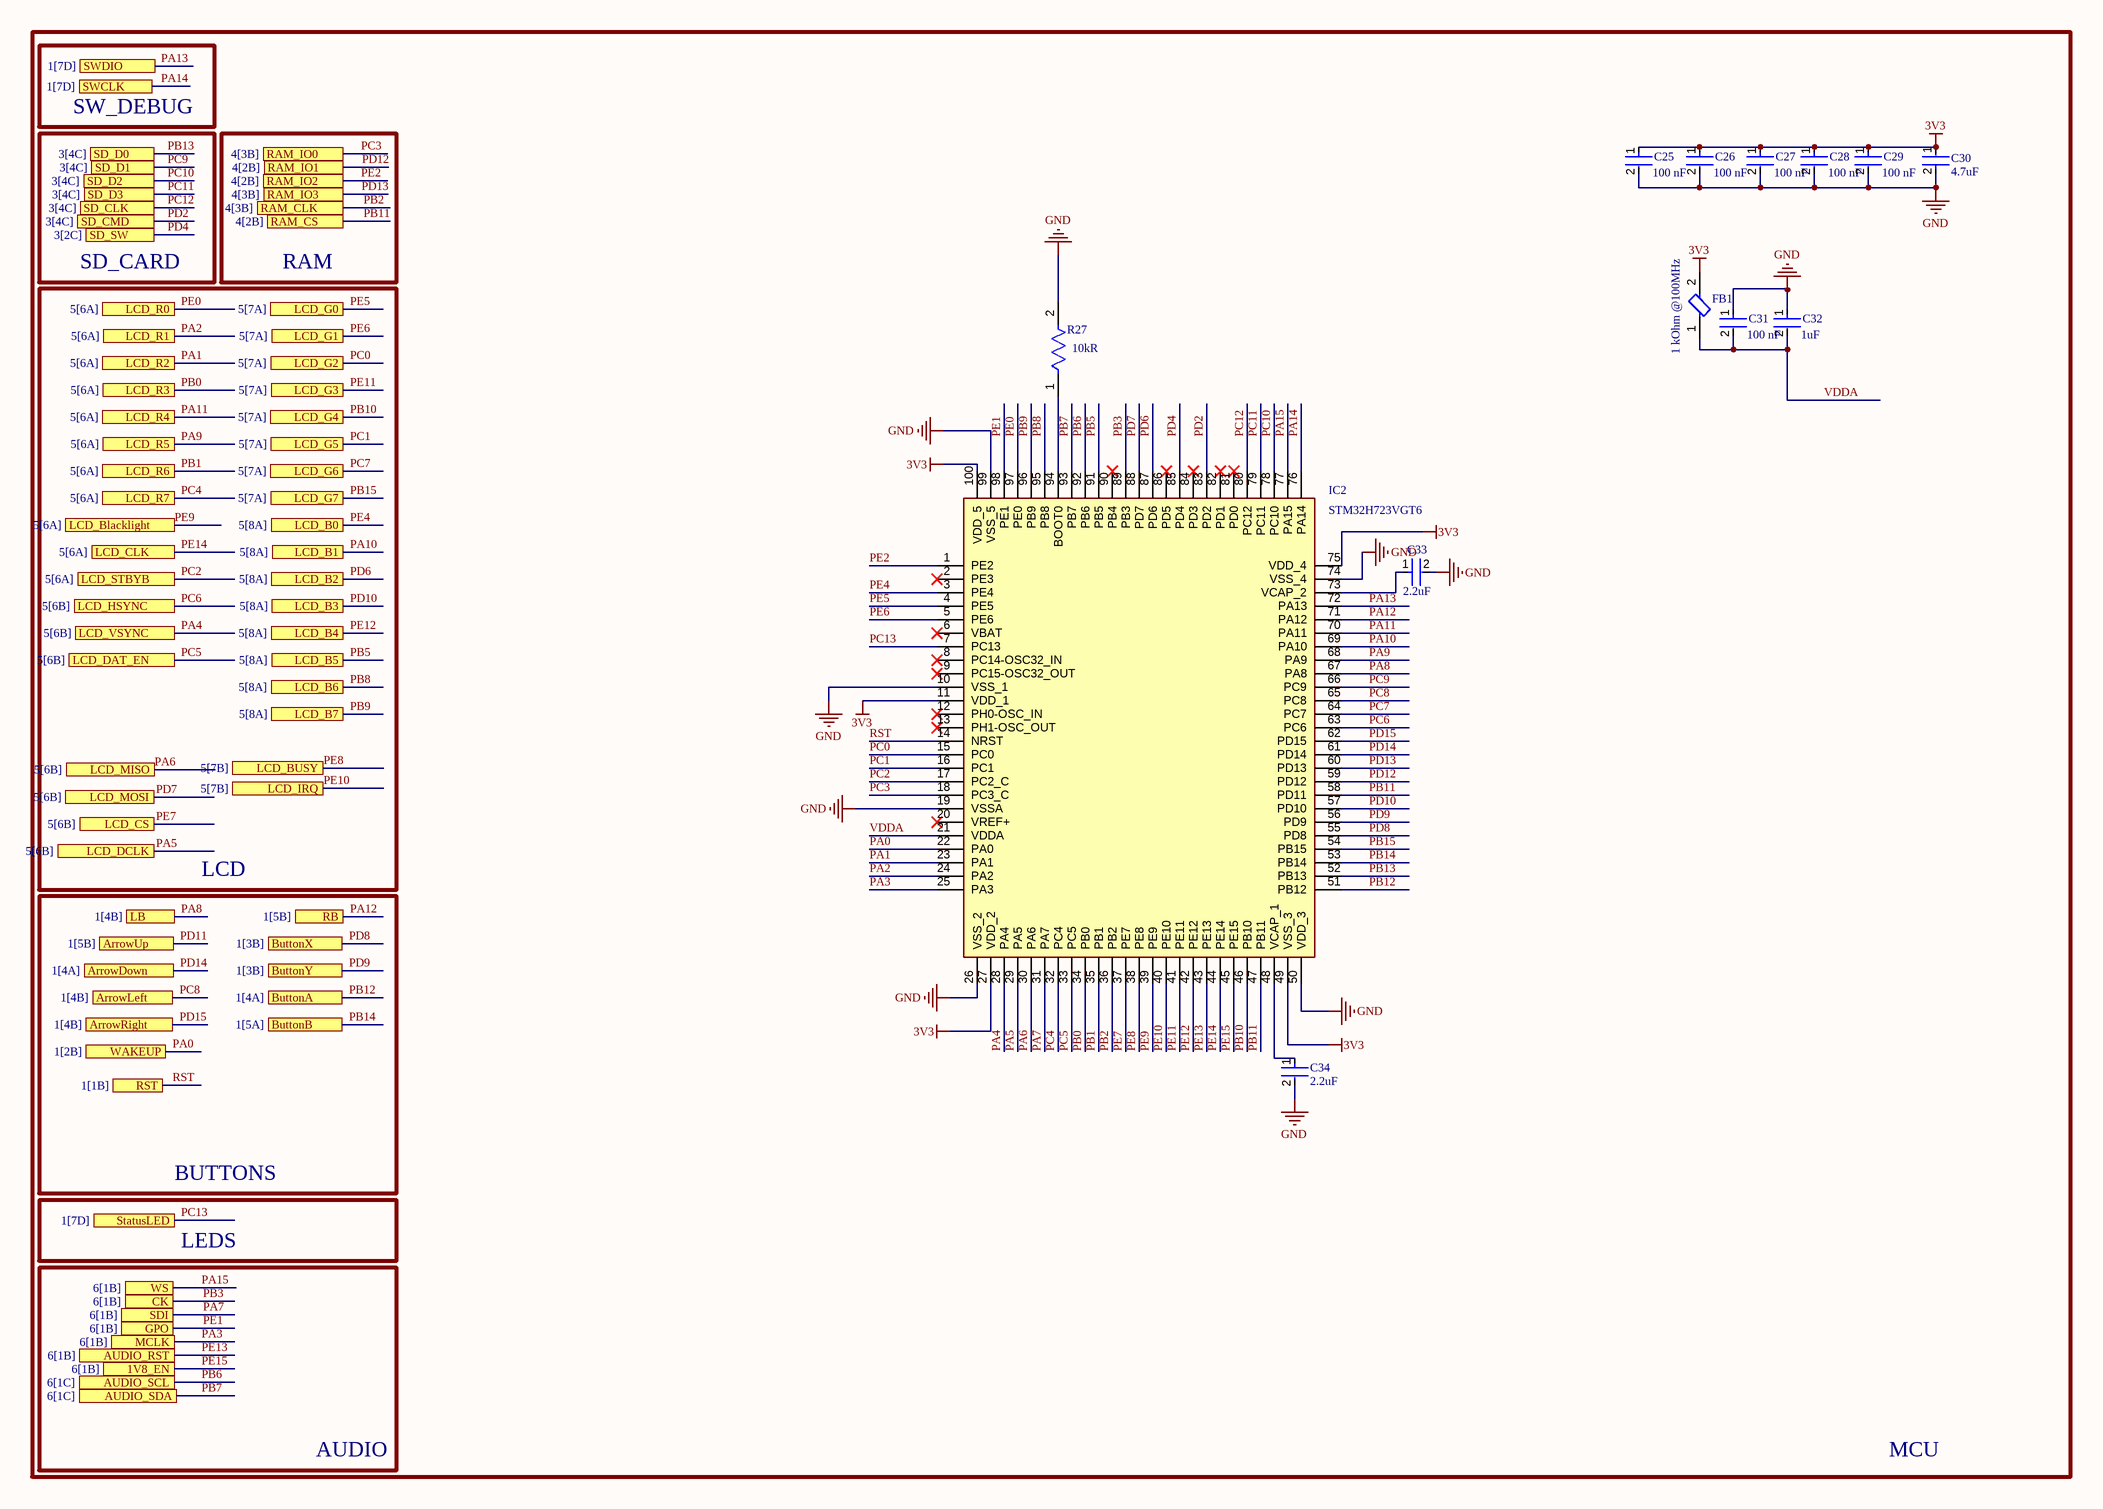
[diagram p2: MCU.SchDoc]

### Parts
C25  value 100 nF  [FP-AC0402-0_5-MFG]  (hidden comment: AC0402KRX7R7BB104)
C26  value 100 nF  [FP-AC0402-0_5-MFG]  (hidden comment: AC0402KRX7R7BB104)
C27  value 100 nF  [FP-AC0402-0_5-MFG]  (hidden comment: AC0402KRX7R7BB104)
C28  value 100 nF  [FP-AC0402-0_5-MFG]  (hidden comment: AC0402KRX7R7BB104)
C29  value 100 nF  [FP-AC0402-0_5-MFG]  (hidden comment: AC0402KRX7R7BB104)
C30  Capacitance: 4.7uF  [FP-0402-L_1_0_0_15-W_0_5-IPC_B]  (hidden comment: JMK105BBJ475MVHF)
C31  value 100 nF  [FP-AC0402-0_5-MFG]  (hidden comment: AC0402KRX7R7BB104)
C32  Capacitance: 1uF  [FP-GRM155-0_1-IPC_A]  (hidden comment: GRM155C70J105KE11D)
C33  Capacitance: 2.2uF  [FP-GRM155-0_2-IPC_B]  (hidden comment: GRM155R61C225KE11D)
C34  Capacitance: 2.2uF  [FP-GRM155-0_2-IPC_B]  (hidden comment: GRM155R61C225KE11D)
FB1  value 1 kOhm @100MHz  [FP-BLM21-0_2-t0_85-e0_5-d-IPC_A]  (hidden comment: BLM21SP102SN1D)
IC2  STM32H723VGT6  [QFP50P1600X1600X160-100N]
R27  Resistance: 10kR  [FP-RK73H1E-IPC_C]  (hidden comment: RK73H1ETTPD1002F)

### Ports
1V8_EN (see 6[1B]), ArrowDown (see 1[4A]), ArrowLeft (see 1[4B]), ArrowRight (see 1[4B]), ArrowUp (see 1[5B]), AUDIO_RST (see 6[1B]), AUDIO_SCL (see 6[1C]), AUDIO_SDA (see 6[1C]), ButtonA (see 1[4A]), ButtonB (see 1[5A]), ButtonX (see 1[3B]), ButtonY (see 1[3B]), CK (see 6[1B]), GPO (see 6[1B]), LB (see 1[4B]), LCD_B0 (see 5[8A]), LCD_B1 (see 5[8A]), LCD_B2 (see 5[8A]), LCD_B3 (see 5[8A]), LCD_B4 (see 5[8A]), LCD_B5 (see 5[8A]), LCD_B6 (see 5[8A]), LCD_B7 (see 5[8A]), LCD_Blacklight (see 5[6A]), LCD_BUSY (see 5[7B]), LCD_CLK (see 5[6A]), LCD_CS (see 5[6B]), LCD_DAT_EN (see 5[6B]), LCD_DCLK (see 5[6B]), LCD_G0 (see 5[7A]), LCD_G1 (see 5[7A]), LCD_G2 (see 5[7A]), LCD_G3 (see 5[7A]), LCD_G4 (see 5[7A]), LCD_G5 (see 5[7A]), LCD_G6 (see 5[7A]), LCD_G7 (see 5[7A]), LCD_HSYNC (see 5[6B]), LCD_IRQ (see 5[7B]), LCD_MISO (see 5[6B]), LCD_MOSI (see 5[6B]), LCD_R0 (see 5[6A]), LCD_R1 (see 5[6A]), LCD_R2 (see 5[6A]), LCD_R3 (see 5[6A]), LCD_R4 (see 5[6A]), LCD_R5 (see 5[6A]), LCD_R6 (see 5[6A]), LCD_R7 (see 5[6A]), LCD_STBYB (see 5[6A]), LCD_VSYNC (see 5[6B]), MCLK (see 6[1B]), RAM_CLK (see 4[3B]), RAM_CS (see 4[2B]), RAM_IO0 (see 4[3B]), RAM_IO1 (see 4[2B]), RAM_IO2 (see 4[2B]), RAM_IO3 (see 4[3B]), RB (see 1[5B]), RST (see 1[1B]), SD_CLK (see 3[4C]), SD_CMD (see 3[4C]), SD_D0 (see 3[4C]), SD_D1 (see 3[4C]), SD_D2 (see 3[4C]), SD_D3 (see 3[4C]), SD_SW (see 3[2C]), SDI (see 6[1B]), StatusLED (see 1[7D]), SWCLK (see 1[7D]), SWDIO (see 1[7D]), WAKEUP (see 1[2B]), WS (see 6[1B])

### Nets
3V3: C25.1 C26.1 C27.1 C28.1 C29.1 C30.1 FB1.2 IC2.11(VDD_1) IC2.27(VDD_2) IC2.49(VSS_3) IC2.75(VDD_4) IC2.100(VDD_5)  [project net AVDD]
GND: C25.2 C26.2 C27.2 C28.2 C29.2 C30.2 C31.1 C32.1 C33.2 C34.2 IC2.10(VSS_1) IC2.19(VSSA) IC2.26(VSS_2) IC2.50(VDD_3) IC2.74(VSS_4) IC2.99(VSS_5) R27.2
PA0: IC2.22(PA0) ; port WAKEUP
PA1: IC2.23(PA1) ; port LCD_R2
PA2: IC2.24(PA2) ; port LCD_R1
PA3: IC2.25(PA3) ; port MCLK  [project net MCLK]
PA4: IC2.28(PA4) ; port LCD_VSYNC
PA5: IC2.29(PA5) ; port LCD_DCLK  [project net DCLK]
PA6: IC2.30(PA6) ; port LCD_MISO  [project net DOUT]
PA7: IC2.31(PA7) ; port SDI  [project net DIN_AUDIO]
PA8: IC2.67(PA8) ; port LB
PA9: IC2.68(PA9) ; port LCD_R5
PA10: IC2.69(PA10) ; port LCD_B1  [project net B1]
PA11: IC2.70(PA11) ; port LCD_R4
PA12: IC2.71(PA12) ; port RB
PA13: IC2.72(PA13) ; port SWDIO
PA14: IC2.76(PA14) ; port SWCLK
PA15: IC2.77(PA15) ; port WS
PB0: IC2.34(PB0) ; port LCD_R3
PB1: IC2.35(PB1) ; port LCD_R6
PB2: IC2.36(PB2) ; port RAM_CLK
PB3: IC2.89(PB3) ; port CK  [project net BCLK]
PB5: IC2.91(PB5) ; port LCD_B5  [project net B5]
PB6: IC2.92(PB6) ; port AUDIO_SCL
PB7: IC2.93(PB7) ; port AUDIO_SDA
PB8: IC2.95(PB8) ; port LCD_B6  [project net B6]
PB9: IC2.96(PB9) ; port LCD_B7  [project net B7]
PB10: IC2.46(PB10) ; port LCD_G4  [project net G4]
PB11: IC2.47(PB11) IC2.58(PD11) ; port RAM_CS
PB12: IC2.51(PB12) ; port ButtonA
PB13: IC2.52(PB13) ; port SD_D0  [project net MicroSD_D0]
PB14: IC2.53(PB14) ; port ButtonB
PB15: IC2.54(PB15) ; port LCD_G7  [project net G7]
PC0: IC2.15(PC0) ; port LCD_G2  [project net G2]
PC1: IC2.16(PC1) ; port LCD_G5  [project net G5]
PC2: IC2.17(PC2_C) ; port LCD_STBYB  [project net DISP/STBYB]
PC3: IC2.18(PC3_C) ; port RAM_IO0
PC4: IC2.32(PC4) ; port LCD_R7
PC5: IC2.33(PC5) ; port LCD_DAT_EN  [project net DEN]
PC6: IC2.63(PC6) ; port LCD_HSYNC  [project net HSYNC/HSD]
PC7: IC2.64(PC7) ; port LCD_G6  [project net G6]
PC8: IC2.65(PC8) ; port ArrowLeft
PC9: IC2.66(PC9) ; port SD_D1  [project net MicroSD_D1]
PC10: IC2.78(PC10) ; port SD_D2  [project net MicroSD_D2]
PC11: IC2.79(PC11) ; port SD_D3  [project net MicroSD_D3]
PC12: IC2.80(PC12) ; port SD_CLK  [project net MicroSD_CLK]
PC13: IC2.7(PC13) ; port StatusLED
PD2: IC2.83(PD2) ; port SD_CMD  [project net MicroSD_CMD]
PD4: IC2.85(PD4) ; port SD_SW  [project net MicroSD_SW]
PD6: IC2.87(PD6) ; port LCD_B2  [project net B2]
PD7: IC2.88(PD7) ; port LCD_MOSI  [project net DIN]
PD8: IC2.55(PD8) ; port ButtonX
PD9: IC2.56(PD9) ; port ButtonY
PD10: IC2.57(PD10) ; port LCD_B3  [project net B3]
PD12: IC2.59(PD12) ; port RAM_IO1
PD13: IC2.60(PD13) ; port RAM_IO3
PD14: IC2.61(PD14) ; port ArrowDown
PD15: IC2.62(PD15) ; port ArrowRight
PE0: IC2.97(PE0) ; port LCD_R0
PE1: IC2.98(PE1) ; port GPO  [project net GPIO1]
PE2: IC2.1(PE2) ; port RAM_IO2
PE4: IC2.3(PE4) ; port LCD_B0  [project net B0]
PE5: IC2.4(PE5) ; port LCD_G0  [project net G0]
PE6: IC2.5(PE6) ; port LCD_G1  [project net G1]
PE7: IC2.37(PE7) ; port LCD_CS  [project net CS]
PE8: IC2.38(PE8) ; port LCD_BUSY  [project net BUSY]
PE9: IC2.39(PE9) ; port LCD_Blacklight
PE10: IC2.40(PE10) ; port LCD_IRQ
PE11: IC2.41(PE11) ; port LCD_G3  [project net G3]
PE12: IC2.42(PE12) ; port LCD_B4  [project net B4]
PE13: IC2.43(PE13) ; port AUDIO_RST
PE14: IC2.44(PE14) ; port LCD_CLK  [project net CLK]
PE15: IC2.45(PE15) ; port 1V8_EN
RST: IC2.14(NRST) ; port RST
VDDA: C31.2 C32.2 FB1.1 IC2.21(VDDA)
NetC33_1: C33.1 IC2.73(VCAP_2)
NetC34_1: C34.1 IC2.48(VCAP_1)
NetIC2_94: IC2.94(BOOT0) R27.1

Not connected (* = marked no-connect by the designer): IC2 2(PE3)* 6(VBAT)* 8(PC14-OSC32_IN)* 9(PC15-OSC32_OUT)* 12(PH0-OSC_IN)* 13(PH1-OSC_OUT)* 20(VREF+)* 81(PD0)* 82(PD1)* 84(PD3)* 86(PD5)* 90(PB4)*

### Notes on the sheet
- SW_DEBUG
- SD_CARD
- RAM
- LCD
- BUTTONS
- LEDS
- AUDIO
- MCU
- DWG NO:
- REV:
- THIS DOCUMENT AND THE DATA DISCLOSED HEREIN OR
- HEREWITH IS THE PROPERTY OF ALTIUM LIMITED AND MAY
- BE FREELY DISTRIBUTED IN WHOLE. NO RIGHTS ARE
- RESERVED OR EXPRESS OR IMPLIED WARANTEE GIVEN.
- REVISION
- DESCRIPTION
- DATE
- APPROVED
- ENG:
- APPROVALS
- PROJECT
- DSN:
- CHK:
- REFERENCE DOCUMENTS
- PROJECT REVISION:
- TITLE
- DOCUMENT REVISION:
- DESIGN ITEM:
- BOM:
- FAB DWG:
- PCB DWG:
- ASSY DWG:
- SCALE:
- A2
- SIZE
- CAGE CODE
- FILE NAME
- DWG NO.
- SHEET
- OF
- REV

### Library data of the parts
C25-C29 C31 = CMP-03422-000136-1: 0.10µF 16V Ceramic Capacitor X7R 0402 (1005 Metric) 0.039" L x 0.020" W (1.00mm x 0.50mm); Manufacturer: Yageo; Tolerance: 0.1; Automotive Grade: Grade 1; Temperature Coefficient: ±15%; Description: AC0402 100 nF X7R 10.00% 16 V; Height: 0.55mm; Device Class L1: Passive Components; Voltage Rating: 16 V; Category: Cap; Package: AC0402-0.5; Mouser Description: AC Series 0402 0.1 uF 16V ±10% X7R Multilayer Ceramic Capacitor; Octopart: https://octopart.com/ac0402krx7r7bb104-yageo-71334186; Device Class L3: Ceramic Capacitors; Ipc Land Pattern Name: CAPC10050X50; Manufacturer Part Number: AC0402KRX7R7BB104; Footprint Url: http://www.yageo.com/exep/pages/download/literatures/UPY-C_GEN_24.pdf; Temperature: -55°C to +125°C; Material: Ceramic; RoHS: TRUE; ComponentLink2URL: http://www.yageo.com/documents/recent/UPY-AC_NP0X7R_16V-to-630V_12.pdf; Lead Free: Yes; Digikey Description: 0.10µF 16V Ceramic Capacitor X7R 0402 (1005 Metric) 0.039" L x 0.020" W (1.00mm x 0.50mm); Device Class L2: Capacitors; Temperature Range Low: -55°C; ComponentLink2Description: Datasheet; Capacitance: 100 nF; Temperature Characteristic: X7R; Automotive: Yes; Temperature Range High: +125°C
C30 = CMP-14477-001359-2: None; Voltage Rating (DC): 6.3V; Dielectric: X5R; Tolerance: 20%; Width: 0.5mm; Package Quantity: 10000; Thickness: 0.026inch; Halogen Free: Halogen Free; Weight: 2.3E-05oz; Ratings: AEC-Q200; Case/Package: 0402; Contact Plating: Tin; Length: 1mm; Lead Free: Lead Free; Case Code (Imperial): 0402; Termination: SMD/SMT; RoHS Compliant: Yes; Max Operating Temperature: 85°C; Mount: Surface Mount; Packaging: Tape and Reel; Min Operating Temperature: -55°C; Case Code (Metric): 1005; Voltage Rating: 6.3V; Height: 0.5mm
C32 = CMP-06035-005209-1: Chip Multilayer Ceramic Capacitors for General Purpose, 0402, 1.0uF, X7S, 22%, 10%, 6.3V; Thickness: 500um; Length: 1mm; Width: 500um; Tolerance: 10%; Dielectric: X7S; Voltage Rating (DC): 6.3V
C33 C34 = CMP-06035-001793-1: Chip Multilayer Ceramic Capacitors for General Purpose, 0402, 2.2uF, X5R, 15%, 10%, 16V; Tolerance: 10%; Packaging: Tape and Reel; Lead Free: Lead Free; Mount: Surface Mount; Width: 0.02inch; Case/Package: 0402; Case Code (Metric): 1005; Thickness: 0.022inch; Max Operating Temperature: 85°C; Min Operating Temperature: -55°C; Voltage Rating: 16V; Voltage Rating (DC): 16V; Material: Ceramic; Height: 0.3mm; Case Code (Imperial): 0402; Length: 0.039inch
FB1 = CMP-06046-001860-1: Chip Ferrite Bead, 0805, 1000Ω @ 100MHz, 0.12Ω, 25%, 1.6A; RoHS Compliant: Yes
IC2 = STM32H723VGT6: Integrated Circuit; Manufacturer_Name: STMicroelectronics; Datasheet Link: https://www.arrow.com/en/products/stm32h723vgt6/stmicroelectronics; Height: 1.6mm; Manufacturer_Part_Number: STM32H723VGT6; Mouser Part Number: 511-STM32H723VGT6; Mouser Price/Stock: https://www.mouser.co.uk/ProductDetail/STMicroelectronics/STM32H723VGT6?qs=sPbYRqrBIVmhrTQw3EmwTA%3D%3D; Arrow Part Number: STM32H723VGT6; Arrow Price/Stock: https://www.arrow.com/en/products/stm32h723vgt6/stmicroelectronics?utm_currency=USD&region=nac
R27 = CMP-04015-078367-1: 10kΩ ±1% 0.1W Chip Resistor 0402 Thick Film AEC-Q200 Qualified; Temperature Coefficient: 100ppm/°C; Power Rating: 62.5mW; Voltage Rating (DC): 50V; Width: 500um; Case/Package: 0402; Length: 1mm

## Sheet SDCARD.SchDoc
size A4; SheetNumber: 3; SheetTotal: 6
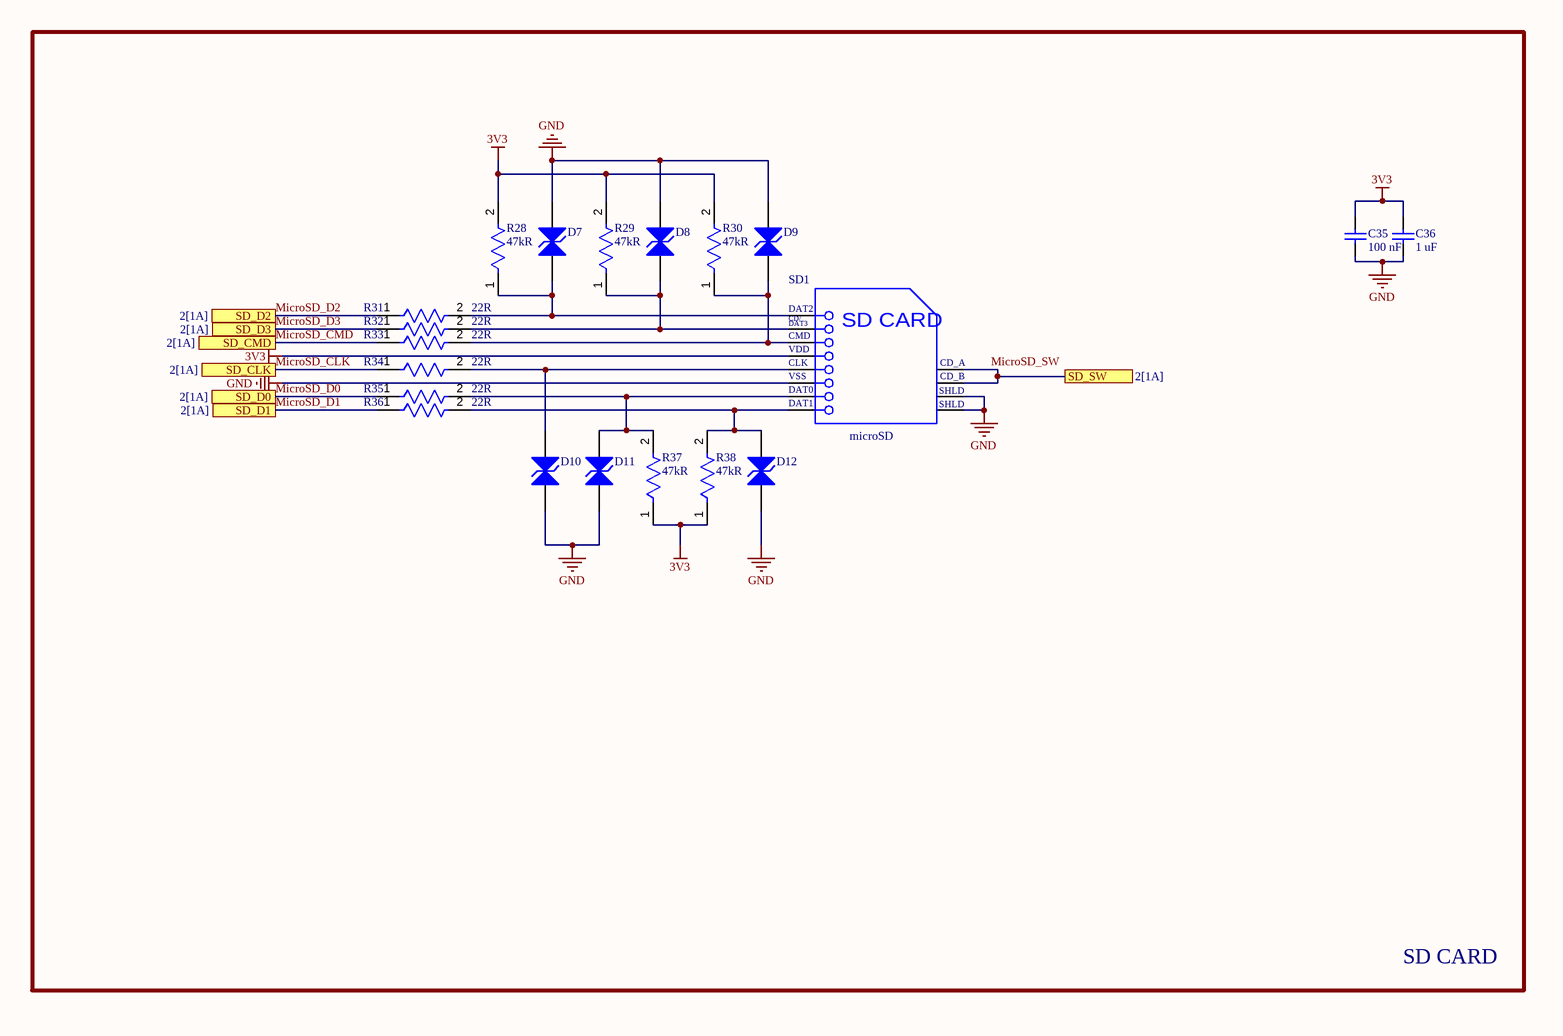
[diagram p3: SDCARD.SchDoc]

### Parts
C35  value 100 nF  [CAPC2013X145X50LL20T25]  (hidden comment: C0805C104K9RACTU)
C36  value 1 uF  [CAPC2013X135X45LL10T25]  (hidden comment: GRM21BR60J225KA01K)
D7  SMAJ5.0CA-E3/5A  [VISH-DO-214AC-2_N]  (value not drawn)
D8  SMAJ5.0CA-E3/5A  [VISH-DO-214AC-2_N]  (value not drawn)
D9  SMAJ5.0CA-E3/5A  [VISH-DO-214AC-2_N]  (value not drawn)
D10  SMAJ5.0CA-E3/5A  [VISH-DO-214AC-2_N]  (value not drawn)
D11  SMAJ5.0CA-E3/5A  [VISH-DO-214AC-2_N]  (value not drawn)
D12  SMAJ5.0CA-E3/5A  [VISH-DO-214AC-2_N]  (value not drawn)
R28  Resistance: 47kR  [FP-CRCW0805-e3-MFG]  (hidden comment: CRCW080547K0JNEA)
R29  Resistance: 47kR  [FP-CRCW0805-e3-MFG]  (hidden comment: CRCW080547K0JNEA)
R30  Resistance: 47kR  [FP-CRCW0805-e3-MFG]  (hidden comment: CRCW080547K0JNEA)
R31  Resistance: 22R  [FP-KTR10-IPC_C]  (hidden comment: KTR10EZPF22R0)
R32  Resistance: 22R  [FP-KTR10-IPC_C]  (hidden comment: KTR10EZPF22R0)
R33  Resistance: 22R  [FP-KTR10-IPC_C]  (hidden comment: KTR10EZPF22R0)
R34  Resistance: 22R  [FP-KTR10-IPC_C]  (hidden comment: KTR10EZPF22R0)
R35  Resistance: 22R  [FP-KTR10-IPC_C]  (hidden comment: KTR10EZPF22R0)
R36  Resistance: 22R  [FP-KTR10-IPC_C]  (hidden comment: KTR10EZPF22R0)
R37  Resistance: 47kR  [FP-CRCW0805-e3-MFG]  (hidden comment: CRCW080547K0JNEA)
R38  Resistance: 47kR  [FP-CRCW0805-e3-MFG]  (hidden comment: CRCW080547K0JNEA)
SD1  Card Type: microSD  [MOLX-104031-0811_V]  (hidden comment: 104031-0811)

### Ports
SD_CLK (see 2[1A]), SD_CMD (see 2[1A]), SD_D0 (see 2[1A]), SD_D1 (see 2[1A]), SD_D2 (see 2[1A]), SD_D3 (see 2[1A]), SD_SW (see 2[1A])

### Nets
3V3: C35.2 C36.2 R28.2 R29.2 R30.2 R37.1 R38.1 SD1.4(VDD)  [project net AVDD]
GND: C35.1 C36.1 D7.1(A1) D8.1(A1) D9.1(A1) D10.2(A2) D11.2(A2) D12.2(A2) SD1.6(VSS2) SD1.11(SHLD1) SD1.12(SHLD2)
MicroSD_CLK: R34.1 ; port SD_CLK
MicroSD_CMD: R33.1 ; port SD_CMD
MicroSD_D0: R35.1 ; port SD_D0
MicroSD_D1: R36.1 ; port SD_D1
MicroSD_D2: R31.1 ; port SD_D2
MicroSD_D3: R32.1 ; port SD_D3
MicroSD_SW: SD1.9(CD_A) SD1.10(CD_B) ; port SD_SW
NetD7_2: D7.2(A2) R28.1 R31.2 SD1.1(CD/DAT3)
NetD8_2: D8.2(A2) R29.1 R32.2 SD1.2(CMD)
NetD9_2: D9.2(A2) R30.1 R33.2 SD1.3(VSS1)
NetD10_1: D10.1(A1) R34.2 SD1.5(CLK)
NetD11_1: D11.1(A1) R35.2 R37.2 SD1.7(DAT0)
NetD12_1: D12.1(A1) R36.2 R38.2 SD1.8(DAT1)

### Notes on the sheet
- SD CARD
- DWG. NO.
- REV.
- SHT.
- REVISION
- DESCRIPTION
- DATE
- APPROVED
- THIS DOCUMENT AND THE DATA DISCLOSED HEREIN OR HEREWITH IS THE PROPERTY OF ALTIUM LIMITED AND MAY BE FREELY DISTRIBUTED IN WHOLE. NO RIGHTS ARE RESERVED OR EXPRESS OR IMPLIED WARANTEE GIVEN.
- ENG:
- DSN:
- APPROVALS
- PROJECT
- DOCUMENT REVISION:
- DESIGN ITEM:
- CHK:
- BOM:
- REFERENCE DOCUMENTS
- PROJECT REVISION:
- TITLE
- FAB DWG:
- PCB DWG:
- ASSY DWG:
- SCALE:
- SIZE
- D
- CAGE CODE
- FILE NAME
- DWG NO.
- SHEET
- OF
- REV
- (in symbol CMP-2000-05825-1) DAT2; CD/; DAT3; SD CARD; VSS; SHLD

### Library data of the parts
C35 = CMP-1036-04391-2: Manufacturer: Kemet; Part Number: C0805C104K9RACTU
C36 = CMP-2007-03531-1: Manufacturer: Murata; Part Number: GRM21BR60J225KA01K
D7-D12 = CMP-0548-00276-2: Transient Voltage Suppressor, 6.40 to 231 V, 5 V Stand-off Voltage, Bi-Directional, -55 to 155 degC, 2-pin DO-214AC, Pb-Free, Tape and Reel; Manufacturer: Vishay Semiconductor; PPPM (W): 400, 300; VBR Bi-Directional (V): 6.4 to 231; ID (uA): 1600; IFSM: 40 A; VWM (V): 5; RoHS: TRUE; Operating Junction and Storage Temperature Range: -55 to 150 degC; Packing: Tape and Reel; ComponentLink1URL: http://www.vishay.com/; Mounting Technology: Surface Mount; ComponentLink2URL: http://www.vishay.com/docs/88390/smaj50a.pdf; PartNumber: SMAJ5.0CA-E3/5A; PackageReference: DO-214AC-2; ComponentLink1Description: Manufacturer URL; ComponentLink3Description: Package Specification; ComponentLink2Description: Datasheet; PackageDescription: 2-Pin DO-214AC (SMA), Body 4.245 x 2.665 mm; DatasheetVersion: 12/8/2013; ComponentLink3URL: http://www.vishay.com/docs/88390/smaj50a.pdf
R28-R30 R37 R38 = CMP-2001-03940-2: RES Thick Film, 47kΩ, 5%, 0.125W, 200ppm/°C, 0805; Voltage Rating: 150V; Power Rating: 125mW; Package Quantity: 5000; Radiation Hardening: No; Composition: Thick Film; Case/Package: 0805; Depth: 1.25mm; Min Operating Temperature: -55°C; Case Code (Imperial): 0805; Weight: 0.000194oz; Width: 1.25mm; Height: 0.45mm; Number of Terminations: 2; Voltage Rating (DC): 150V; Termination: SMD/SMT; Max Operating Temperature: 155°C; Case Code (Metric): 2012; Military Standard: Not; Length: 2mm; Tolerance: 5%; Packaging: Tape and Reel; Working Voltage: 150V; Lead Free: Lead Free; Temperature Coefficient: 200ppm/°C; Contact Plating: Tin
R31-R36 = CMP-08839-031728-1: Res Thick Film 0805 22Ω 1% 0.125W ±100ppm/°C Automotive Paper T/R; Max Power Dissipation: 125mW; Temperature Coefficient: 100ppm/°C; Width: 0.049inch; Length: 0.079inch; Number of Terminations: 2; Case/Package: 0805; Tolerance: 1%; Case Code (Imperial): 0805; Features: Automotive AEC-Q200; Case Code (Metric): 2012; Resistor Type: Thick Film; Min Operating Temperature: -55°C; RoHS Compliant: Yes; Height: 0.026inch; Package Quantity: 5000; Max Operating Temperature: 155°C; Series: KTR; Packaging: Cut Tape
SD1 = CMP-2000-05825-1: Micro SD Card, RA, -25 to 85 degC, 8-Pin SMD, RoHS, Tape and Reel; Voltage Rating: 10VAC/DC; Number of Contacts: 8; Insertion - Extraction Style: Push-Pull; Pitch: 1.1mm; Mating Cycles: 10000; Brand: Molex; Current Rating: 500mA; Manufacturer URL: http://www.molex.com/; Mounting Type: Standard; Height: 1.42mm; Mounting Technology: SurfaceMount; Contact Plating: Gold; Product Category: MemoryCardConnectors; Package Description: 8-Pin Surface Mount Device, Body 11.95 x 11.4 mm, Pitch 1.1 mm; Datasheet URL: http://www.molex.com/pdm_docs/sd/1040310811_sd.pdf; Termination Style: SMD; Length: 11.4mm; Housing Material: LiquidCrystalPolymer(LCP); Orientation: RightAngle; RoHS: True; Contact Material: PhosphorBronze; Datasheet Version: Rev. E, 04/2006; Packaging: Reel; Manufacturer: Molex; Series: 104031; Product: CardConnectors; Number of Rows: 1Row; Package Reference: 104031-0811

## Sheet RAM.SchDoc
size A4; SheetNumber: 4; SheetTotal: 6
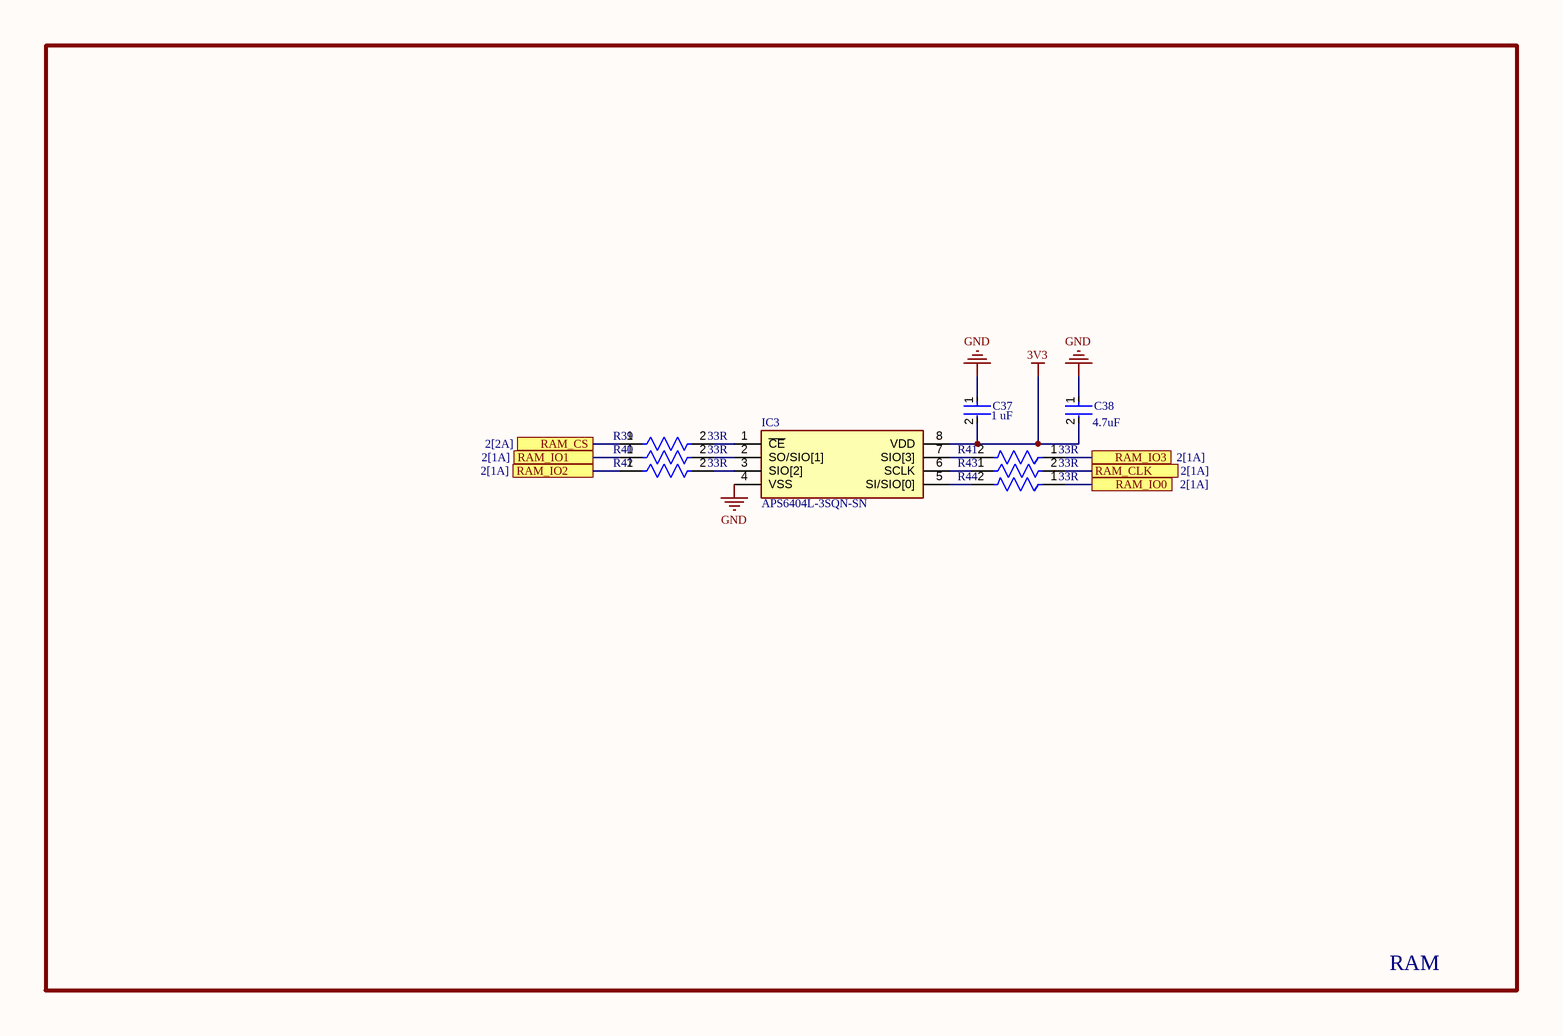
[diagram p4: RAM.SchDoc]

### Parts
C37  Capacitance: 1 uF  [FP-CC0805-0_85-MFG]  (hidden comment: CC0805KKX5R6BB105)
C38  Capacitance: 4.7uF  [FP-C2012-125-0_2-IPC_B]  (hidden comment: C2012X7R1A475K125AC)
IC3  APS6404L-3SQN-SN  [SOIC127P600X175-8N]
R39  Resistance: 33R  [FP-RMCF0805-MFG]  (hidden comment: RMCF0805FT33R0)
R40  Resistance: 33R  [FP-RMCF0805-MFG]  (hidden comment: RMCF0805FT33R0)
R41  Resistance: 33R  [FP-RMCF0805-MFG]  (hidden comment: RMCF0805FT33R0)
R42  Resistance: 33R  [FP-RMCF0805-MFG]  (hidden comment: RMCF0805FT33R0)
R43  Resistance: 33R  [FP-RMCF0805-MFG]  (hidden comment: RMCF0805FT33R0)
R44  Resistance: 33R  [FP-RMCF0805-MFG]  (hidden comment: RMCF0805FT33R0)

### Ports
RAM_CLK (see 2[1A]), RAM_CS (see 2[2A]), RAM_IO0 (see 2[1A]), RAM_IO1 (see 2[1A]), RAM_IO2 (see 2[1A]), RAM_IO3 (see 2[1A])

### Nets
3V3: C37.2 C38.2 IC3.8(VDD)  [project net AVDD]
GND: C37.1 C38.1 IC3.4(VSS)
PB2: R43.2 ; port RAM_CLK
PB11: R39.1 ; port RAM_CS
PC3: R44.1 ; port RAM_IO0
PD12: R40.1 ; port RAM_IO1
PD13: R41.1 ; port RAM_IO3
PE2: R42.1 ; port RAM_IO2
NetIC3_1: IC3.1(~{CE}) R39.2
NetIC3_2: IC3.2(SO/SIO[1]) R40.2
NetIC3_3: IC3.3(SIO[2]) R42.2
NetIC3_5: IC3.5(SI/SIO[0]) R44.2
NetIC3_6: IC3.6(SCLK) R43.1
NetIC3_7: IC3.7(SIO[3]) R41.2

### Notes on the sheet
- RAM
- DWG NO:
- REV:
- THIS DOCUMENT AND THE DATA DISCLOSED HEREIN OR
- HEREWITH IS THE PROPERTY OF ALTIUM LIMITED AND MAY
- BE FREELY DISTRIBUTED IN WHOLE. NO RIGHTS ARE
- RESERVED OR EXPRESS OR IMPLIED WARANTEE GIVEN.
- REVISION
- DESCRIPTION
- DATE
- APPROVED
- ENG:
- APPROVALS
- PROJECT
- DSN:
- CHK:
- REFERENCE DOCUMENTS
- PROJECT REVISION:
- TITLE
- DOCUMENT REVISION:
- DESIGN ITEM:
- BOM:
- FAB DWG:
- PCB DWG:
- ASSY DWG:
- SCALE:
- A2
- SIZE
- CAGE CODE
- FILE NAME
- DWG NO.
- SHEET
- OF
- REV

### Library data of the parts
C37 = CMP-03422-000746-1: CAP CER 1UF 10V X5R 0805; Manufacturer: Yageo; Material: Ceramic; Tolerance: 0.1; Height: 0.95mm; Mouser Description: Multilayer Ceramic Capacitors MLCC - SMD/SMT 1.0uF 10V X5R 10%; Device Class L1: Passive Components; Temperature Range High: +85°C; ComponentLink2URL: http://www.yageo.com/documents/recent/UPY-GPHC_Y5V_6.3V-to-50V_8.pdf; Lead Free: Yes; Automotive: No; Package: CC0805-0.85; Temperature Range Low: -30°C; Device Class L2: Capacitors; Octopart: https://octopart.com/cc0805kkx5r6bb105-yageo-9292777; Category: Cap; Temperature: -30°C to +85°C; Device Class L3: Ceramic Capacitors; Value: 1 uF; ComponentLink2Description: Datasheet; Manufacturer Part Number: CC0805KKX5R6BB105; Temperature Characteristic: X5R; Footprint Url: http://www.yageo.com/exep/pages/download/literatures/UPY-C_GEN_24.pdf; RoHS: TRUE; Ipc Land Pattern Name: CAPC200125X85; Voltage Rating: 10 V; Digikey Description: CAP CER 1UF 10V X5R 0805
C38 = CMP-08246-006484-1: Multilayer Ceramic Capacitors 4.7μF ±10% 10V X7R SMD 0805; Dielectric: X7R; Thickness: 0.057inch; Min Operating Temperature: -55°C; Width: 0.049inch; Construction: Flat; Lead Free: Lead Free; Case Code (Imperial): 0805; Number of Pins: 2; RoHS Compliant: Yes; Termination: SMD/SMT; Tolerance: 10%; Resistor Type: Ceramic; Series: C; Voltage Rating: 10V; Depth: 1.25mm; Height: 1.25mm; Max Operating Temperature: 125°C; Mount: Surface Mount; Package Quantity: 2000; Weight: 0.000194oz; Radiation Hardening: No; REACH SVHC: No SVHC; Case Code (Metric): 2012; Length: 2mm; Packaging: Tape and Reel; Case/Package: 0805; Dielectric Material: Ceramic; Voltage Rating (DC): 10V
IC3 = APS6404L-3SQN-SN: Integrated Circuit; Manufacturer_Name: apmemory; Datasheet Link: https://www.mouser.es/datasheet/2/1127/APM_PSRAM_E3_QSPI__APS6404L_SQH_KGD_PKG__v4_1-3623360.pdf; Height: 1.75mm; Manufacturer_Part_Number: APS6404L-3SQN-SN
R39-R44 = CMP-26527-003272-1: 33Ω ±1% 0.125W 0805 Thick Film Chip Resistor AEC-Q200 compliant; Max Power Dissipation: 125mW; Temperature Coefficient: 100ppm/°C; Height: 0.026inch; Contact Plating: Tin; Features: Automotive AEC-Q200; RoHS Compliant: Yes; Number of Terminations: 2; Min Operating Temperature: -55°C; Length: 0.079inch; Case/Package: 0805; Case Code (Metric): 2012; Series: RMCF; Width: 0.049inch; Mount: Surface Mount; Radiation Hardening: No; Case Code (Imperial): 0805; Tolerance: 1%; Packaging: Tape and Reel; Max Operating Temperature: 155°C; Resistor Type: Thick Film